# EAGLE schematic 555-ramp-generator (EAGLE 5.10)
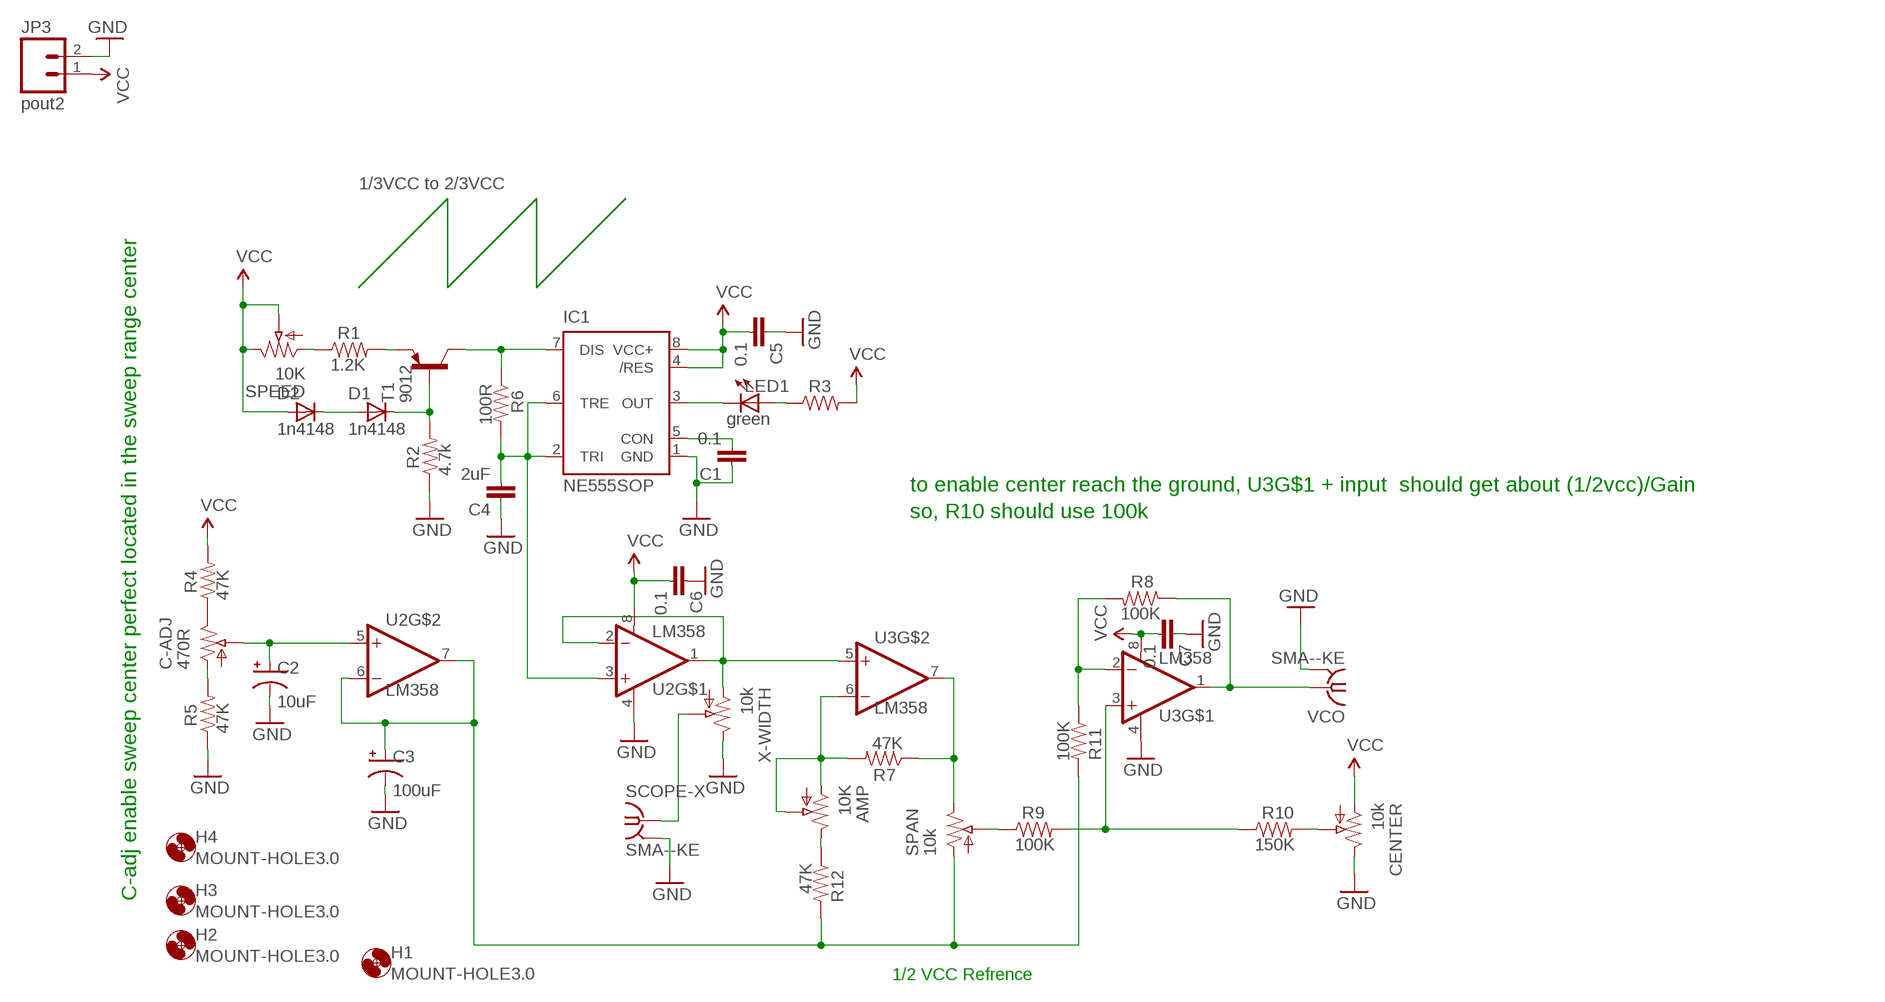
[diagram p0: schematic, sheet 1]

## Parts
AMP  10K  POTB25P-3362P  [B25P]
C1  0.1  CAP-C0805  [C0805]
C2  10uF  CAP_POL1206  [EIA3216]
C3  100uF  CAP_POL-CT6032  [CT6032]
C4  2uF  CAP-C0805  [C0805]
C5  0.1  CAP-C0805  [C0805]
C6  0.1  CAP-C0805  [C0805]
C7  0.1  CAP-C0805  [C0805]
C-ADJ  470R  POTB25P-3362P  [B25P]
CENTER  10k  POTPANNEL  [POT-PANNEL]
D1  1n4148  DIODE1206  [1206-DIODE]
D2  1n4148  DIODE1206  [1206-DIODE]
H1  MOUNT-HOLE3.0  [3,0]
H2  MOUNT-HOLE3.0  [3,0]
H3  MOUNT-HOLE3.0  [3,0]
H4  MOUNT-HOLE3.0  [3,0]
IC1  NE555SOP  [SO08-DS]
JP3  pout2  CON-02LOCK_LONGPADS  [1X02_LOCK_LONGPADS]
LED1  green  LED0805  [CHIPLED_0805]
R1  1.2K  RESISTOR-R0805W  [R0805W]
R2  4.7k  RESISTOR-R0805W  [R0805W]
R3  RESISTOR-R0805W  [R0805W]
R4  47K  RESISTOR-R0805W  [R0805W]
R5  47K  RESISTOR-R0805W  [R0805W]
R6  100R  RESISTOR-R0805W  [R0805W]
R7  47K  RESISTOR-R0805W  [R0805W]
R8  100K  RESISTOR-R0805W  [R0805W]
R9  100K  RESISTOR-R0805W  [R0805W]
R10  150K  RESISTOR-R0805W  [R0805W]
R11  100K  RESISTOR-R0805W  [R0805W]
R12  47K  RESISTOR-R0805W  [R0805W]
SCOPE-X  SMA--KE  [SMA-KE]
SPAN  10k  POTPANNEL  [POT-PANNEL]
SPEED  10K  POTB25P-3362P  [B25P]
T1  9012  90**-PNP-SOT23-BEC  [SOT23-BEC]
U2  LM358  LM358-SO08  [SO08]
U3  LM358  LM358-SO08  [SO08]
VCO  SMA--KE  [SMA-KE]
X-WIDTH  10k  POTPANNEL  [POT-PANNEL]

## Nets
GND: C1.1 C2.C(-) C3.- C4.1 C5.1 C6.1 C7.1 CENTER.E IC1.1(GND) JP3.2 R2.1 R5.1 SCOPE-X.G@1(GND) U2.4(V-) U3.4(V-) VCO.G@1(GND) X-WIDTH.E
N$1: IC1.3(OUT) LED1.C
N$2: D1.K(C) R2.2 T1.B
N$3: LED1.A R3.1
N$4: C1.2 IC1.5(CON)
N$5: D1.A D2.K(C)
N$6: R1.2 T1.E
N$7: R1.1 SPEED.A
N$8: C4.2 IC1.2(TRI) IC1.6(TRE) R6.2 U2.3(+IN)
N$9: IC1.7(DIS) R6.1 T1.C
N$10: C2.A(+) C-ADJ.S U2.5(+IN)
N$11: C-ADJ.E R4.1
N$12: SCOPE-X.1 X-WIDTH.S
N$13: U2.1(OUT) U2.2(-IN) U3.5(+IN) X-WIDTH.A
N$14: AMP.A AMP.S R7.2 U3.6(-IN)
N$15: CENTER.S R10.2
N$16: R7.1 SPAN.E U3.7(OUT)
N$17: R9.2 R10.1 U3.3(+IN)
N$18: R8.1 U3.1(OUT) VCO.1
N$19: R9.1 SPAN.S
N$21: R8.2 R11.1 U3.2(-IN)
N$22: AMP.E R12.1
N$23: C-ADJ.A R5.2
REF: C3.+ R11.2 R12.2 SPAN.A U2.6(-IN) U2.7(OUT)
VCC: C5.2 C6.2 C7.2 CENTER.A D2.A IC1.4(/RES) IC1.8(VCC+) JP3.1 R3.2 R4.2 SPEED.E SPEED.S U2.8(V+) U3.8(V+)

## Notes on the sheet
- 1/3VCC to 2/3VCC
- to enable center reach the ground, U3G$1 + input  should get about (1/2vcc)/Gain
- so, R10 should use 100k
- C-adj enable sweep center perfect located in the sweep range center
- 1/2 VCC Refrence

## Power pins joined to a net without a drawn wire
GND: SCOPE-X.G@2(GND) SCOPE-X.G@3(GND) SCOPE-X.G@4(GND) VCO.G@2(GND) VCO.G@3(GND) VCO.G@4(GND)

## Library data of the parts
AMP C-ADJ CENTER SPAN SPEED X-WIDTH = digital-toy:POT: POT digital toy POT, 3296 multi turn, blue-white ... hyl 8/07/2001
C1 C4-C7 = digital-toy:CAP: Capacitor Standard 0603 ceramic capacitor, and 0.1" leaded capacitor.
C2 C3 = digital-toy:CAP_POL: Capacitor Polarized These are standard SMD and PTH capacitors. Normally 10uF, 47uF, and 100uF in electrolytic and tantalum varieties. Always verify the external diameter of the through hole cap, it varies with capacity, voltage, and manufacturer. The EIA devices should be standard. PANASONIC_D size: 6.5mmx6.5mmx5.5mm, 100uf (taobao:6.3mmx5.5mm), same as CVL0605 153cvl0405 size: 4mmx4mmx5.5mm, 10uf (taobao:4mmx5.5mm) ct6032 typical 47uF Tantalum, comment by hyl.
D1 D2 = digital-toy:DIODE: Diode These are standard reverse protection diodes and small signal diodes. SMA package can handle up to about 1A. SOD-323 can handle about 200mA. What the SOD-323 package when ordering, there are some mfgs out there that are 5-pin packages.
H1-H4 = holes:MOUNT-HOLE: MOUNTING HOLE with drill center marker
IC1 = digital-toy:NE555: General purpose bipolar Timer
JP3 = digital-toy:CON-02: Header 2 Standard 2-pin 0.1" header. Use with straight break away headers (SKU : PRT-00116), right angle break away headers (PRT-00553), swiss pins (PRT-00743), machine pins (PRT-00117), and female headers (PRT-00115). Molex polarized connector foot print use with SKU : PRT-08233 with associated crimp pins and housings.
LED1 = digital-toy:LED: LEDs Standard schematic elements and footprints for 5mm, 3mm, 1206, and 0603 sized LEDs. 5mm - Spark Fun Electronics SKU : COM-00529 (and others) copy led.lbr 0805 led here, by hyl digital-toy. 2010.6.29
R1-R12 = digital-toy:RESISTOR: Resistor Basic schematic elements and footprints for 0603, 1206, and PTH 1/10th watt (small) resistors. digital-toy copy vertical mount of axial-0.3 from rcl.lbr : the 0207/xx 3W resistor: 0617/17, 0617/22, 0617V
SCOPE-X VCO = dtoy-RF:SMA-: SMA 50 Ohm End Launch Jack Receptacle - Round Contact Johnson Components Source: www.johnsoncomponents.com .. J502-ND.pdf
T1 = digital-toy:*-PNP-: PNP Transistror
U2 U3 = digital-toy:LM358